# EAGLE schematic HARE_schematic_10172017 (EAGLE 8.4.0)
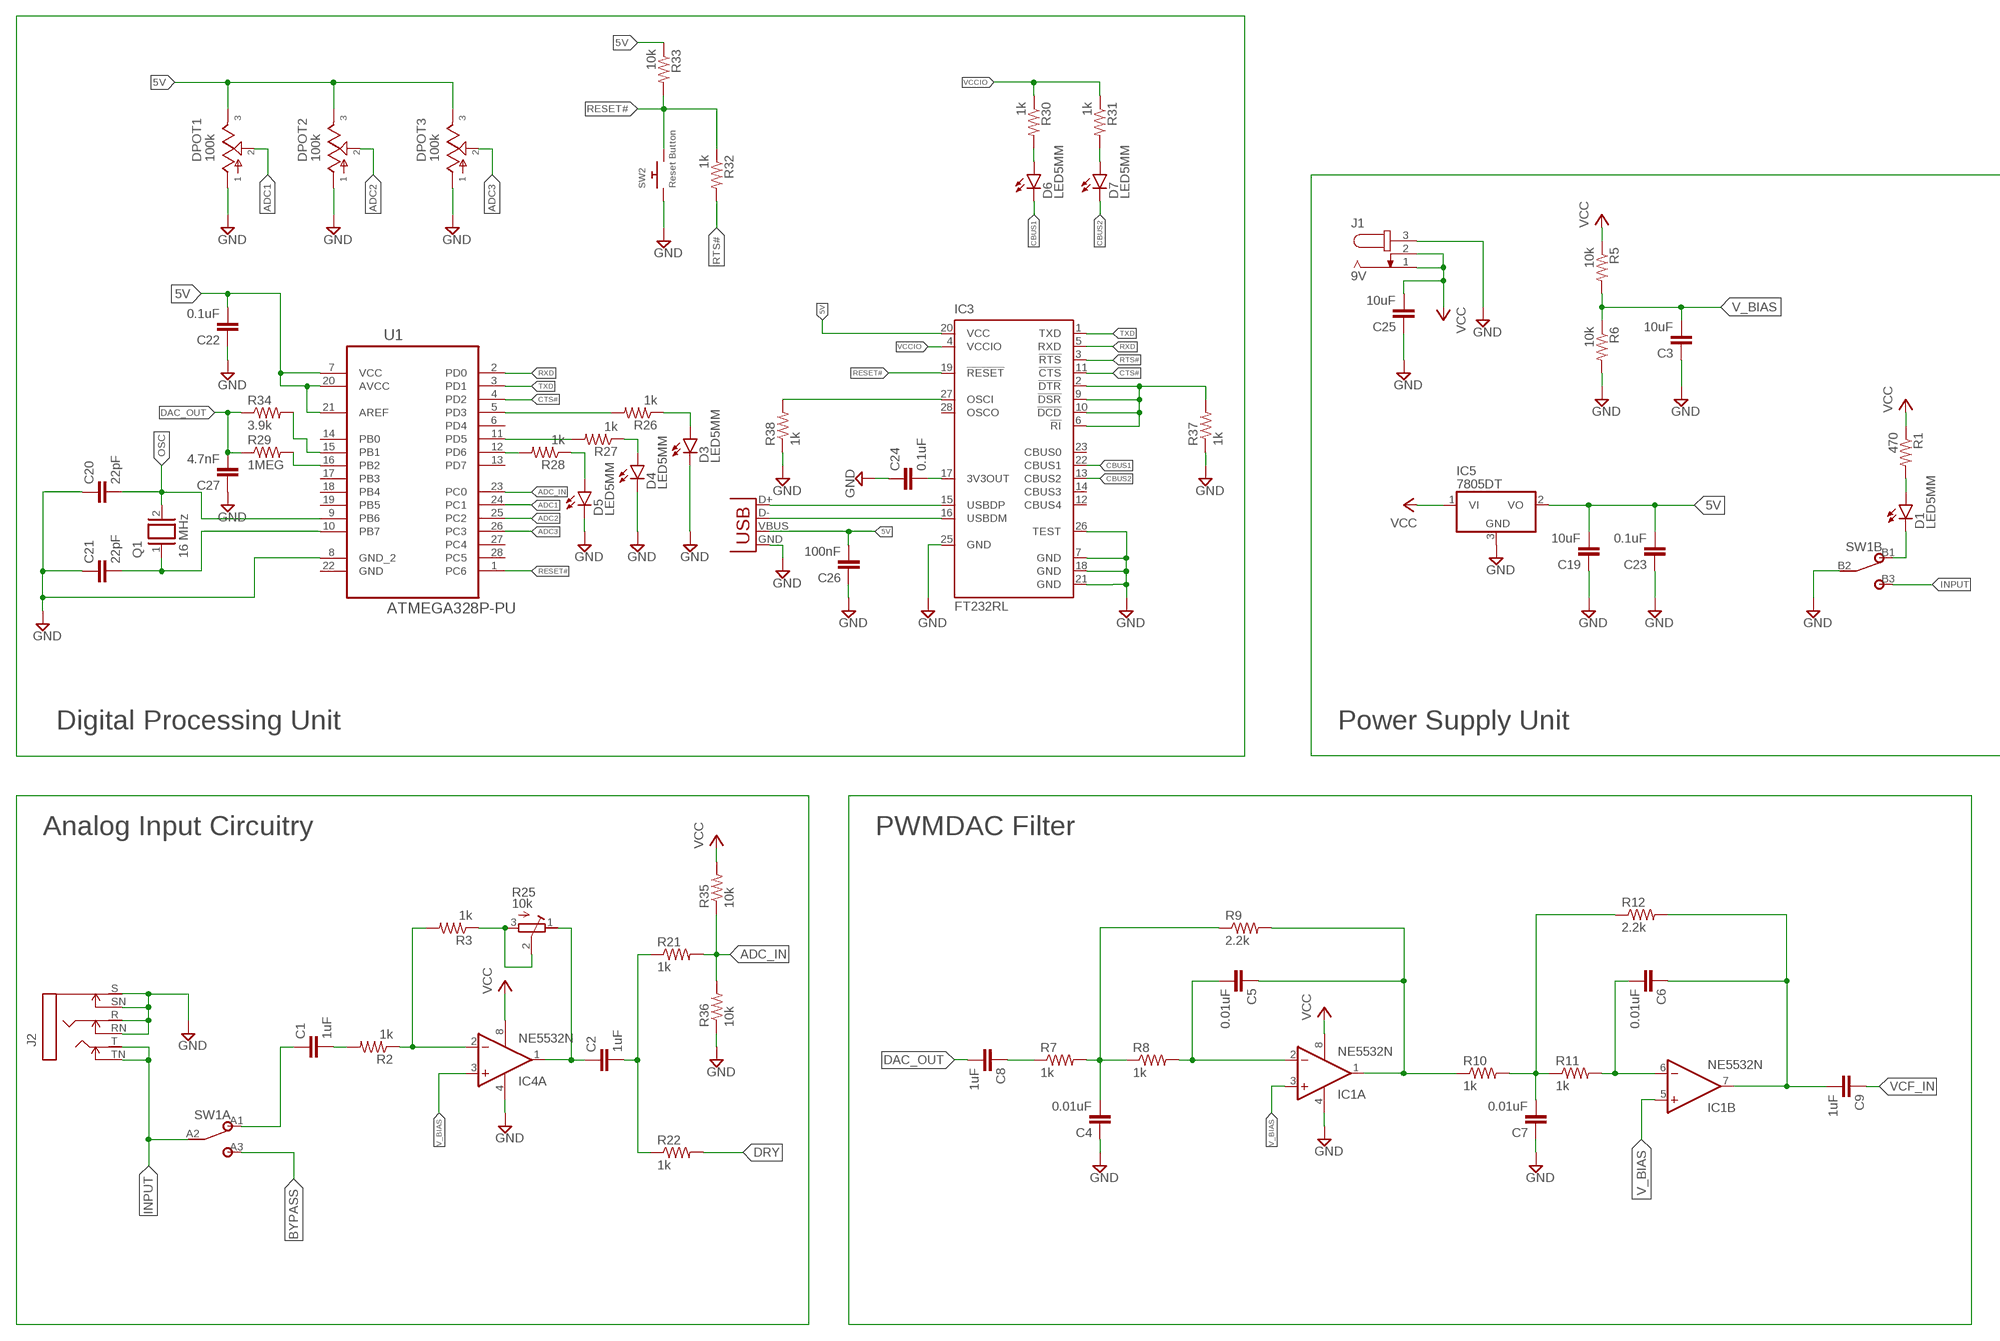
[diagram p0: schematic, sheet 1, part 1 of 2]
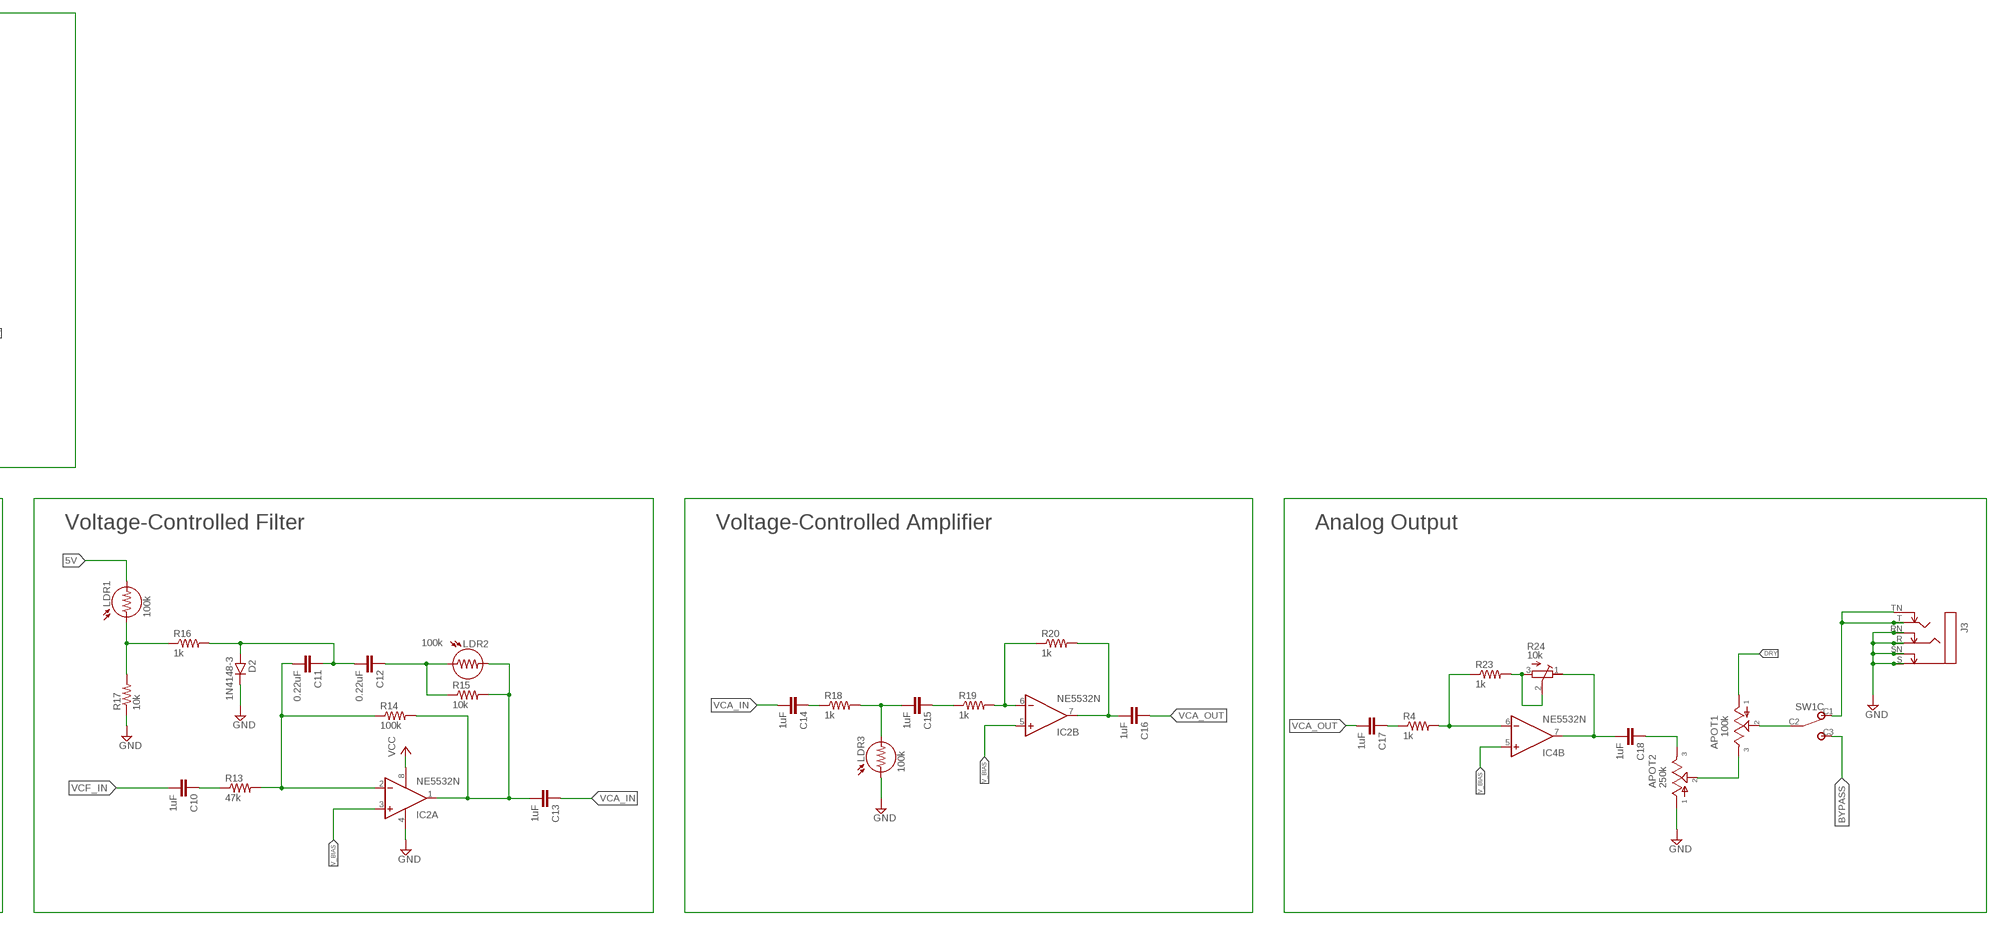
[diagram p1: schematic, sheet 1, part 2 of 2]

## Parts
APOT1  100k  POTS  [16MM-SQUARE]
APOT2  250k  POTS  [16MM-SQUARE]
C1  1uF  C-EUC0805K  [C0805K]
C2  1uF  C-EUC0805K  [C0805K]
C3  10uF  C-EUC0805K  [C0805K]
C4  0.01uF  C-EUC0805K  [C0805K]
C5  0.01uF  C-EUC0805K  [C0805K]
C6  0.01uF  C-EUC0805K  [C0805K]
C7  0.01uF  C-EUC0805K  [C0805K]
C8  1uF  C-EUC0805K  [C0805K]
C9  1uF  C-EUC0805K  [C0805K]
C10  1uF  C-EUC0805K  [C0805K]
C11  0.22uF  C-EUC0805K  [C0805K]
C12  0.22uF  C-EUC0805K  [C0805K]
C13  1uF  C-EUC0805K  [C0805K]
C14  1uF  C-EUC0805K  [C0805K]
C15  1uF  C-EUC0805K  [C0805K]
C16  1uF  C-EUC0805K  [C0805K]
C17  1uF  C-EUC0805K  [C0805K]
C18  1uF  C-EUC0805K  [C0805K]
C19  10uF  C-EUC0805K  [C0805K]
C20  22pF  C-EUC0805K  [C0805K]
C21  22pF  C-EUC0805K  [C0805K]
C22  0.1uF  C-EUC0805K  [C0805K]
C23  0.1uF  C-EUC0805K  [C0805K]
C24  0.1uF  C-EUC0805K  [C0805K]
C25  10uF  C-EUC0805K  [C0805K]
C26  100nF  C-EUC0805K  [C0805K]
C27  4.7nF  C-EUC0805K  [C0805K]
D1  LED5MM  [LED5MM]
D2  1N4148-3  [DO35-3]
D3  LED5MM  [LED5MM]
D4  LED5MM  [LED5MM]
D5  LED5MM  [LED5MM]
D6  LED5MM  [LED5MM]
D7  LED5MM  [LED5MM]
DPOT1  100k  POTS  [16MM-SQUARE]
DPOT2  100k  POTS  [16MM-SQUARE]
DPOT3  100k  POTS  [16MM-SQUARE]
IC1  NE5532N  [DIL08]
IC2  NE5532N  [DIL08]
IC3  FT232RL  [SSOP28]
IC4  NE5532N  [DIL08]
IC5  7805DT  [TO252]
J1  9V  JACK-PLUG1  [SPC4078]
J2  STEREOSW  [NMJ6HCD2]
J3  STEREOSW  [NMJ6HCD2]
LDR1  100k  LDR5MM  [LDR338-54C]
LDR2  100k  LDR5MM  [LDR338-54C]
LDR3  100k  LDR5MM  [LDR338-54C]
Q1  16 MHz  XTAL/S  [QS]
R1  470  R-US_M0805  [M0805]
R2  1k  R-US_R0805  [R0805]
R3  1k  R-US_R0805  [R0805]
R4  1k  R-US_R0805  [R0805]
R5  10k  R-US_M0805  [M0805]
R6  10k  R-US_M0805  [M0805]
R7  1k  R-US_R0805  [R0805]
R8  1k  R-US_R0805  [R0805]
R9  2.2k  R-US_R0805  [R0805]
R10  1k  R-US_R0805  [R0805]
R11  1k  R-US_R0805  [R0805]
R12  2.2k  R-US_R0805  [R0805]
R13  47k  R-US_R0805  [R0805]
R14  100k  R-US_R0805  [R0805]
R15  10k  R-US_R0805  [R0805]
R16  1k  R-US_R0805  [R0805]
R17  10k  R-US_R0805  [R0805]
R18  1k  R-US_R0805  [R0805]
R19  1k  R-US_R0805  [R0805]
R20  1k  R-US_R0805  [R0805]
R21  1k  R-US_R0805  [R0805]
R22  1k  R-US_R0805  [R0805]
R23  1k  R-US_R0805  [R0805]
R24  10k  R-TRIMM3314G  [RTRIM3314G]
R25  10k  R-TRIMM3314G  [RTRIM3314G]
R26  1k  R-US_R0805  [R0805]
R27  1k  R-US_R0805  [R0805]
R28  1k  R-US_R0805  [R0805]
R29  1MEG  R-US_R0805  [R0805]
R30  1k  R-US_R0805  [R0805]
R31  1k  R-US_R0805  [R0805]
R32  1k  R-US_R0805  [R0805]
R33  10k  R-US_R0805  [R0805]
R34  3.9k  R-US_R0805  [R0805]
R35  10k  R-US_R0805  [R0805]
R36  10k  R-US_R0805  [R0805]
R37  1k  R-US_R0805  [R0805]
R38  1k  R-US_R0805  [R0805]
SW1  3PDTBLUE  [CHINABLUE]
SW2  Reset Button  SWITCH_PUSHBUTTONSOFTTOUCHSMD_SJ  [PUSHBUTTON_SMD_SJ]
U1  ATMEGA328P-PU  [DIP254P762X457-28]
X2  USB-B-H  [USB-B-H]

## Nets
5V: C19.2 C22.2 C23.2 C26.2 DPOT1.3 DPOT2.3 DPOT3.3 IC3.20(VCC) IC5.2(VO) LDR1.2 R33.1 U1.7(VCC) U1.20(AVCC) U1.21(AREF) X2.VBUS
ADC1: DPOT1.2 U1.24(PC1)
ADC2: DPOT2.2 U1.25(PC2)
ADC3: DPOT3.2 U1.26(PC3)
ADC_IN: R21.2 R35.1 R36.2 U1.23(PC0)
BYPASS: SW1.A3 SW1.C3
CBUS1: D6.K(C) IC3.22(CBUS1)
CBUS2: D7.K(C) IC3.13(CBUS2)
CTS#: IC3.11(!CTS) U1.4(PD2)
DAC_OUT: C8.2 C27.2 R29.1 R34.1
DRY: APOT1.1 R22.2
GND: APOT2.1 C3.1 C4.1 C7.1 C19.1 C20.1 C21.1 C22.1 C23.1 C24.1 C25.1 C26.1 C27.1 D2.C D3.K(C) D4.K(C) D5.K(C) DPOT1.1 DPOT2.1 DPOT3.1 IC1.4(P:V-) IC2.4(P:V-) IC3.7(GND) IC3.18(GND) IC3.21(GND) IC3.25(GND) IC3.26(TEST) IC4.4(P:V-) IC5.3(GND) J1.3 J2.R J2.RN J2.S J2.SN J3.R J3.RN J3.S J3.SN LDR3.1 R6.2 R17.1 R36.1 R37.1 R38.1 SW1.B2 SW2.P$1 U1.8(GND_2) X2.GND
INPUT: J2.T J2.TN SW1.A2 SW1.B3
N$7: D1.A R1.2
N$8: D1.K(C) SW1.B1
N$9: C1.1 SW1.A1
N$10: C1.2 R2.2
N$11: IC4.2(A:-IN) R2.1 R3.2
N$12: C4.2 R7.2 R8.1 R9.1
N$13: C5.2 IC1.2(A:-IN) R8.2
N$14: C5.1 IC1.1(A:OUT) R9.2 R10.1
N$15: C8.1 R7.1
N$16: C7.2 R10.2 R11.1 R12.1
N$17: C6.2 IC1.6(B:-IN) R11.2
N$18: C6.1 C9.2 IC1.7(B:OUT) R12.2
N$19: J3.T J3.TN SW1.C1
N$21: C10.1 R13.1
N$22: C11.2 IC2.2(A:-IN) R13.2 R14.1
N$23: C13.2 IC2.1(A:OUT) LDR2.2 R14.2 R15.2
N$24: IC3.2(!DTR) IC3.6(!RI) IC3.9(!DSR) IC3.10(!DCD) R37.2
N$25: C12.1 LDR2.1 R15.1
N$27: C11.1 C12.2 D2.A R16.2
N$28: IC3.27(OSCI) R38.2
N$29: LDR1.1 R16.1 R17.2
N$30: C14.1 R18.1
N$31: C15.2 LDR3.2 R18.2
N$32: C15.1 R19.1
N$33: IC2.6(B:-IN) R19.2 R20.1
N$34: C16.2 IC2.7(B:OUT) R20.2
N$36: C2.2 R21.1 R22.1
N$37: C2.1 IC4.1(A:OUT) R25.1(E)
N$40: C17.1 R4.1
N$41: IC4.6(B:-IN) R4.2 R23.1
N$42: R23.2 R24.2(S) R24.3(A)
N$43: C18.2 IC4.7(B:OUT) R24.1(E)
N$45: APOT2.3 C18.1
N$46: APOT1.3 APOT2.2
N$47: APOT1.2 SW1.C2
N$49: R3.1 R25.2(S) R25.3(A)
N$50: R29.2 U1.16(PB2)
N$51: C21.2 Q1.1 U1.10(PB7)
N$52: IC3.15(USBDP) X2.D+
N$53: IC3.16(USBDM) X2.D-
N$54: C24.2 IC3.17(3V3OUT)
N$55: R34.2 U1.15(PB1)
N$56: R28.2 U1.12(PD6)
N$57: D5.A R28.1
N$58: R27.2 U1.11(PD5)
N$59: D4.A R27.1
N$60: R26.2 U1.5(PD3)
N$61: D3.A R26.1
N$63: D6.A R30.2
N$64: D7.A R31.2
OSC: C20.2 Q1.2 U1.9(PB6)
RESET#: IC3.19(!RESET) R32.1 R33.2 SW2.P$2 U1.1(PC6)
RTS#: IC3.3(!RTS) R32.2
RXD: IC3.5(RXD) U1.2(PD0)
TXD: IC3.1(TXD) U1.3(PD1)
V_BIAS: C3.2 IC1.3(A:+IN) IC1.5(B:+IN) IC2.3(A:+IN) IC2.5(B:+IN) IC4.3(A:+IN) IC4.5(B:+IN) R5.2 R6.1
VCA_IN: C13.1 C14.2
VCA_OUT: C16.1 C17.2
VCC: C25.2 IC1.8(P:V+) IC2.8(P:V+) IC4.8(P:V+) IC5.1(VI) J1.1 J1.2 R1.1 R5.1 R35.2
VCCIO: IC3.4(VCCIO) R30.1 R31.1
VCF_IN: C9.1 C10.2
Unconnected: IC3.12(CBUS4) IC3.14(CBUS3) IC3.23(CBUS0) IC3.28(OSCO) U1.6(PD4) U1.13(PD7) U1.14(PB0) U1.17(PB3) U1.18(PB4) U1.19(PB5) U1.22(GND) U1.27(PC4) U1.28(PC5)

## Notes on the sheet
- Digital Processing Unit | Power Supply Unit
- Analog Input Circuitry | PWMDAC Filter | Voltage-Controlled Filter | Voltage-Controlled Amplifier | Analog Output

## Library data of the parts
APOT1 APOT2 DPOT1-DPOT3 = gm-pots:POT: Potentiometers the arrow indicates the clockwise motion of th wiper (lug 2) fully counter clockwise there is no resistance between lugs 1 and 2 fully clockwise the resistance between lugs 1 and 2 is the value of the pot
C1-C27 = resistor:C-EU: CAPACITOR, European symbol
D1 D3-D7 = gm-diodes:LED
D2 = gm-diodes:1N4148: Fast Switching Diode DO-35 glass case a.k.a. 1N914
IC1 IC2 IC4 = gm-ics:NE5532: AUDIO AMPLIFIER
IC3 = ftdichip:FT232R: Source: http://www.ftdichip.com/Documents/DataSheets/DS_FT232R_v104.pdf; MPN: FT232RL; OC_FARNELL: 1146032; OC_NEWARK: 91K9918
IC5 = gm-regulators:78*: Positive VOLTAGE REGULATOR Source: http://cache.national.com/ds/LM/LM78L05.pdf http://www.fairchildsemi.com/ds/LM/LM7805.pdf
J1 = con-jack:JACK-PLUG: DC POWER JACK Power Jack, DC, Right Angle, Through Hole, Rated 5A at 16VDC, PC Terminals Distributor: Farnell (www.Farnell.de) Drawing: 84N1161.pdf / 84N1162.pdf Manufacturer: SPC Technology (www.spctechnology.com) Type: SPC4077 / SPC 4078; OC_FARNELL: unknown; OC_NEWARK: unknown
J2 J3 = gm-jacks:STEREOSW
LDR1-LDR3 = gm-resistors:LDR
Q1 = special:XTAL/S: CRYSTAL
R1 R5 R6 = rcl:R-US_: RESISTOR, American symbol
R2-R4 R7-R23 R26-R38 = resistor:R-US_: RESISTOR, American symbol
R24 R25 = resistor:R-TRIMM: Trimm resistor
SW1 = gm-switches:3PDT
SW2 = adafruit:SWITCH_PUSHBUTTON: Buttons SOFTTOUCHSMD_SJ - Soft touch temporary push button (Super Junk Akihabara) Compatible with SKPMANE010 [Mouser: 688-SKPMAN] C&K_KSS = Digikey: KSS221GLFS
U1 = Atmel_By_element14_Batch_1-00:ATMEGA328P-PU: 8-bit Microcontroller with In-System Programmable Flash; MPN: ATMEGA328P-PU; OC_FARNELL: 1715487; OC_NEWARK: 15R0268; PACKAGE: PDIP-28; SUPPLIER: Atmel
X2 = con-usb:USB: USB Connectors